# Altium schematic sheet [04] - USB.SchDoc
size A4
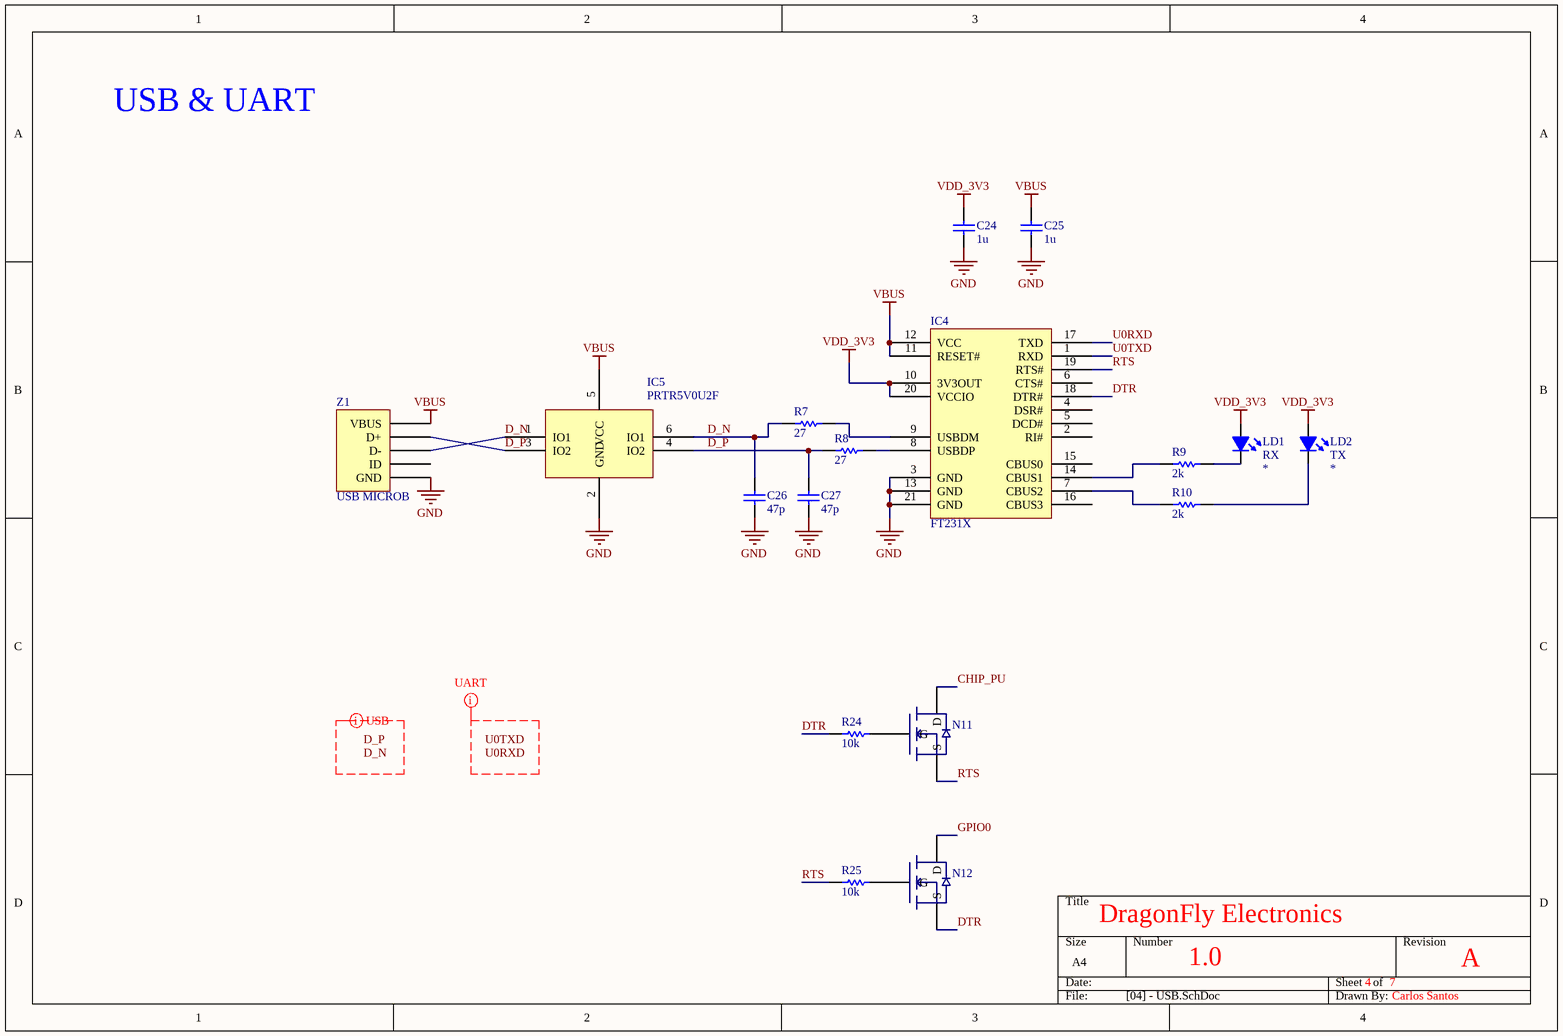
[diagram p0: [04] - USB.SchDoc]

## Parts
C24  value 1u  [0402 - Capacitor]  (hidden comment: Capacitor)
C25  value 1u  [0402 - Capacitor]  (hidden comment: Capacitor)
C26  value 47p  [0402 - Capacitor]  (hidden comment: Capacitor)
C27  value 47p  [0402 - Capacitor]  (hidden comment: Capacitor)
IC4  FT231X  [QFN20-127P600-8N]
IC5  PRTR5V0U2F  [SOT886]
LD1  Color: RX  [0402 - Led]  (hidden comment: Led)
LD2  Color: TX  [0402 - Led]  (hidden comment: Led)
N11  N-MOSFET  [DFN1006-3]  (value not drawn)
N12  N-MOSFET  [DFN1006-3]  (value not drawn)
R7  value 27  [0402 - Resistor]  (hidden comment: Resistor)
R8  value 27  [0402 - Resistor]  (hidden comment: Resistor)
R9  value 2k  [0402 - Resistor]  (hidden comment: Resistor)
R10  value 2k  [0402 - Resistor]  (hidden comment: Resistor)
R24  value 10k  [0402 - Resistor]  (hidden comment: Resistor)
R25  value 10k  [0402 - Resistor]  (hidden comment: Resistor)
Z1  USB MICROB  [USB - microB]

## Nets
GND: C24.1 C25.1 C26.1 C27.1 IC4.3(GND) IC4.13(GND) IC4.21(GND) IC5.2(GND) Z1.5(GND)
VBUS: C25.2 IC4.11(RESET#) IC4.12(VCC) IC5.5(VCC) Z1.1(VBUS)
VDD_3V3: C24.2 IC4.10(3V3OUT) IC4.20(VCCIO) LD1.1(A) LD2.1(A)
CHIP_PU: N11.3(D)
D_N: C26.2 IC5.1(IO1) IC5.6(IO1) R7.1 Z1.2(D-)
D_P: C27.2 IC5.3(IO2) IC5.4(IO2) R8.1 Z1.3(D+)
DTR: IC4.18(DTR#) N12.1(S) R24.1
GPIO0: N12.3(D)
RTS: IC4.19(RTS#) N11.1(S) R25.1
U0RXD: IC4.17(TXD)
U0TXD: IC4.1(RXD)
NetIC4_7: IC4.7(CBUS2) R10.1
NetIC4_8: IC4.8(USBDP) R8.2
NetIC4_9: IC4.9(USBDM) R7.2
NetIC4_14: IC4.14(CBUS1) R9.1
NetLD1_2: LD1.2(K) R9.2
NetLD2_2: LD2.2(K) R10.2
NetN11_2: N11.2(G) R24.2
NetN12_2: N12.2(G) R25.2

Not connected (* = marked no-connect by the designer): IC4 2(RI#) 4(DSR#) 5(DCD#) 6(CTS#) 15(CBUS0) 16(CBUS3); Z1 4(ID)

## Layout directives
net class UART: U0RXD, U0TXD
differential pair: D_N, D_P

## Notes on the sheet
- USB & UART
- DragonFly Electronics
- 1.0
- 4
- 7
- A
- Carlos Santos
- Labels drawn without touching a wire or pin: D_N, D_P, U0RXD, U0TXD

## Library data of the parts
Z1 = USB - microB: 609-4613-1-ND; DigiKey Part #: 609-4613-1-ND
IC4 = FT231X: DigiKey Part #: 768-1128-1-ND
IC5 = PRTR5V0U2F: DigiKey Part #: 1727-4161-6-ND
LD1 LD2 = Led: Vf: *